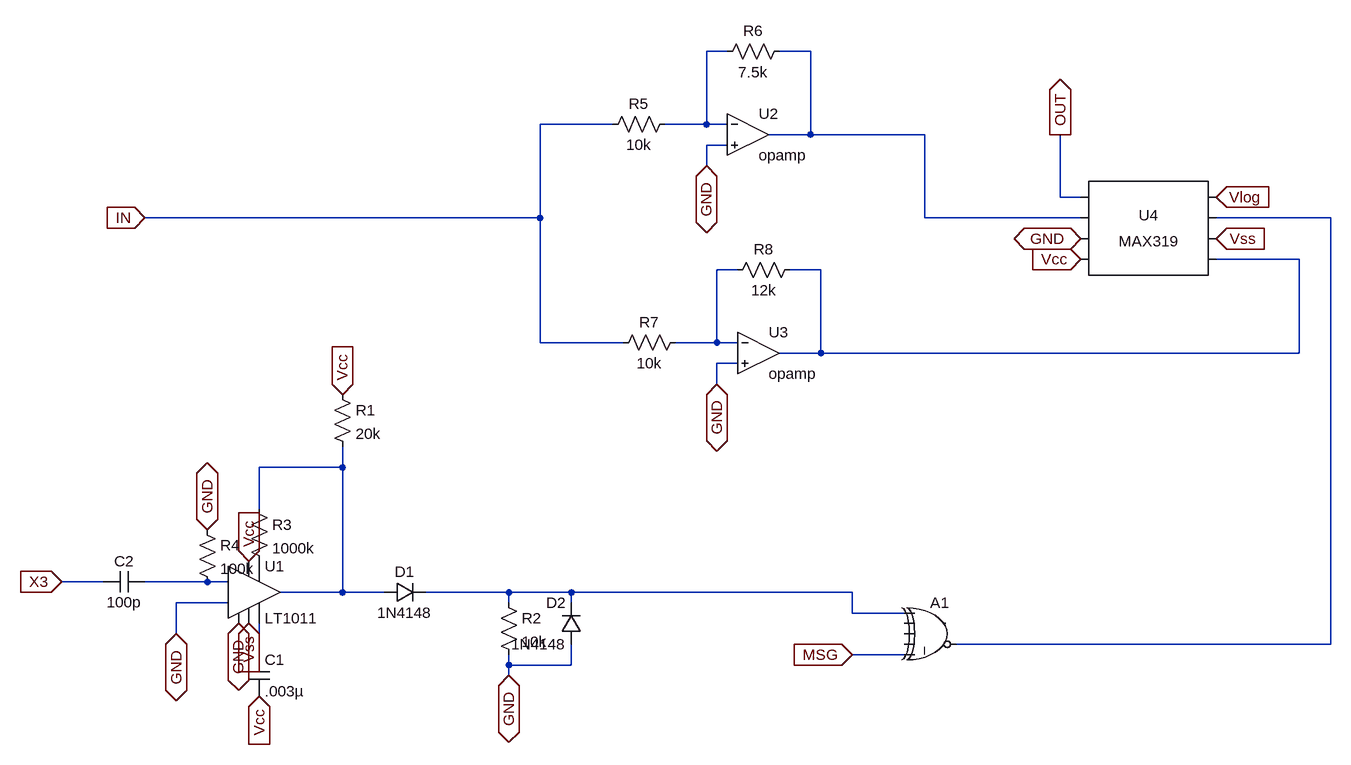
[diagram p0: schematic Draft6.asc]
Draft6.asc, the LTspice schematic file:
Version 4
SHEET 1 880 680
WIRE -1456 -912 -1488 -912
WIRE -1328 -912 -1376 -912
WIRE -1632 -800 -1744 -800
WIRE -1488 -800 -1488 -912
WIRE -1488 -800 -1552 -800
WIRE -1456 -800 -1488 -800
WIRE -1328 -784 -1328 -912
WIRE -1328 -784 -1392 -784
WIRE -1152 -784 -1328 -784
WIRE -1456 -768 -1488 -768
WIRE -1488 -736 -1488 -768
WIRE -944 -688 -944 -784
WIRE -912 -688 -944 -688
WIRE -1744 -656 -1744 -800
WIRE -1744 -656 -2352 -656
WIRE -1152 -656 -1152 -784
WIRE -912 -656 -1152 -656
WIRE -528 -656 -704 -656
WIRE -576 -592 -704 -592
WIRE -1440 -576 -1472 -576
WIRE -1312 -576 -1360 -576
WIRE -1744 -464 -1744 -656
WIRE -1616 -464 -1744 -464
WIRE -1472 -464 -1472 -576
WIRE -1472 -464 -1536 -464
WIRE -1440 -464 -1472 -464
WIRE -1312 -448 -1312 -576
WIRE -1312 -448 -1376 -448
WIRE -576 -448 -576 -592
WIRE -576 -448 -1312 -448
WIRE -1440 -432 -1472 -432
WIRE -1472 -400 -1472 -432
WIRE -2048 -272 -2048 -304
WIRE -2048 -272 -2176 -272
WIRE -2176 -208 -2176 -272
WIRE -2416 -96 -2480 -96
WIRE -2256 -96 -2352 -96
WIRE -2224 -96 -2256 -96
WIRE -2048 -80 -2048 -272
WIRE -2048 -80 -2144 -80
WIRE -1984 -80 -2048 -80
WIRE -1792 -80 -1920 -80
WIRE -1696 -80 -1792 -80
WIRE -1264 -80 -1696 -80
WIRE -2224 -64 -2304 -64
WIRE -1792 -64 -1792 -80
WIRE -1696 -64 -1696 -80
WIRE -1264 -48 -1264 -80
WIRE -1184 -48 -1264 -48
WIRE -2304 -16 -2304 -64
WIRE -528 0 -528 -656
WIRE -528 0 -1104 0
WIRE -2176 16 -2176 -32
WIRE -1184 16 -1264 16
WIRE -1792 32 -1792 16
WIRE -1696 32 -1696 0
WIRE -1696 32 -1792 32
WIRE -1792 48 -1792 32
FLAG -2048 -384 Vcc
IOPIN -2048 -384 In
FLAG -2192 -128 Vcc
IOPIN -2192 -128 In
FLAG -2176 80 Vcc
IOPIN -2176 80 In
FLAG -2192 -32 Vss
IOPIN -2192 -32 In
FLAG -1792 48 GND
IOPIN -1792 48 BiDir
FLAG -2208 -32 GND
IOPIN -2208 -32 BiDir
FLAG -2304 -16 GND
IOPIN -2304 -16 BiDir
FLAG -2256 -176 GND
IOPIN -2256 -176 BiDir
FLAG -1488 -736 GND
IOPIN -1488 -736 BiDir
FLAG -1472 -400 GND
IOPIN -1472 -400 BiDir
FLAG -704 -688 Vlog
IOPIN -704 -688 In
FLAG -912 -592 Vcc
IOPIN -912 -592 In
FLAG -704 -624 Vss
IOPIN -704 -624 In
FLAG -912 -624 GND
IOPIN -912 -624 BiDir
FLAG -2352 -656 IN
IOPIN -2352 -656 In
FLAG -944 -784 OUT
IOPIN -944 -784 Out
FLAG -2480 -96 X3
IOPIN -2480 -96 In
FLAG -1264 16 MSG
IOPIN -1264 16 In
SYMBOL LT1011 -2192 -80 R0
SYMATTR InstName U1
SYMBOL res -2064 -400 R0
SYMATTR InstName R1
SYMATTR Value 20k
SYMBOL res -1808 -80 R0
SYMATTR InstName R2
SYMATTR Value 10k
SYMBOL cap -2192 16 R0
SYMATTR InstName C1
SYMATTR Value .003µ
SYMBOL res -2192 -224 R0
SYMATTR InstName R3
SYMATTR Value 1000k
SYMBOL diode -1984 -64 R270
WINDOW 0 32 32 VTop 2
WINDOW 3 0 32 VBottom 2
SYMATTR InstName D1
SYMATTR Value 1N4148
SYMBOL diode -1680 0 R180
WINDOW 0 24 64 Left 2
WINDOW 3 24 0 Left 2
SYMATTR InstName D2
SYMATTR Value 1N4148
SYMBOL res -2272 -192 R0
SYMATTR InstName R4
SYMATTR Value 100k
SYMBOL opamp -1424 -848 R0
SYMATTR InstName U2
SYMBOL res -1536 -816 R90
WINDOW 0 0 56 VBottom 2
WINDOW 3 32 56 VTop 2
SYMATTR InstName R5
SYMATTR Value 10k
SYMBOL res -1360 -928 R90
WINDOW 0 0 56 VBottom 2
WINDOW 3 32 56 VTop 2
SYMATTR InstName R6
SYMATTR Value 7.5k
SYMBOL opamp -1408 -512 R0
SYMATTR InstName U3
SYMBOL res -1520 -480 R90
WINDOW 0 0 56 VBottom 2
WINDOW 3 32 56 VTop 2
SYMATTR InstName R7
SYMATTR Value 10k
SYMBOL res -1344 -592 R90
WINDOW 0 0 56 VBottom 2
WINDOW 3 32 56 VTop 2
SYMATTR InstName R8
SYMATTR Value 12k
SYMBOL AutoGenerated\\MAX319 -816 -640 R0
SYMATTR InstName U4
SYMBOL Digital\\xor -1136 -80 R0
WINDOW 3 0 0 Invisible 2
SYMATTR InstName A1
SYMATTR Value Vhigh=5 Vlow=0
SYMATTR Value2 Td=2n Trise=10n Tfall=10n
SYMBOL cap -2352 -112 R90
WINDOW 0 0 32 VBottom 2
WINDOW 3 32 32 VTop 2
SYMATTR InstName C2
SYMATTR Value 100p

The netlist it stands for:
* Draft6.asc
XU1 GND GND N007 Vss P001 N009 N006 Vcc LT1011
R1 Vcc N006 20k
R2 N008 GND 10k
C1 N009 Vcc .003µ
R3 N006 P001 1000k
D1 N006 N008 1N4148
D2 GND N008 1N4148
R4 GND N007 100k
XU2 N001 GND N002 opamp Aol=100K GBW=10Meg  ; pins invin noninvin out
R5 N001 IN 10k
R6 N002 N001 7.5k
XU3 N005 GND N004 opamp Aol=100K GBW=10Meg  ; pins invin noninvin out
R7 N005 IN 10k
R8 N004 N005 12k
* U4: MAX319 (symbol AutoGenerated\MAX319 not available, pins judged from their places): pin1=OUT pin2=N002 pin3=GND pin4=Vcc pin5=Vlog pin6=N003 pin7=Vss pin8=N004
A1 N008 0 0 0 MSG N003 0 0 XOR Vhigh=5 Vlow=0 Td=2n Trise=10n Tfall=10n
C2 N007 X3 100p
.model D D
.lib standard.dio
.lib LTC1.lib
.backanno
.end